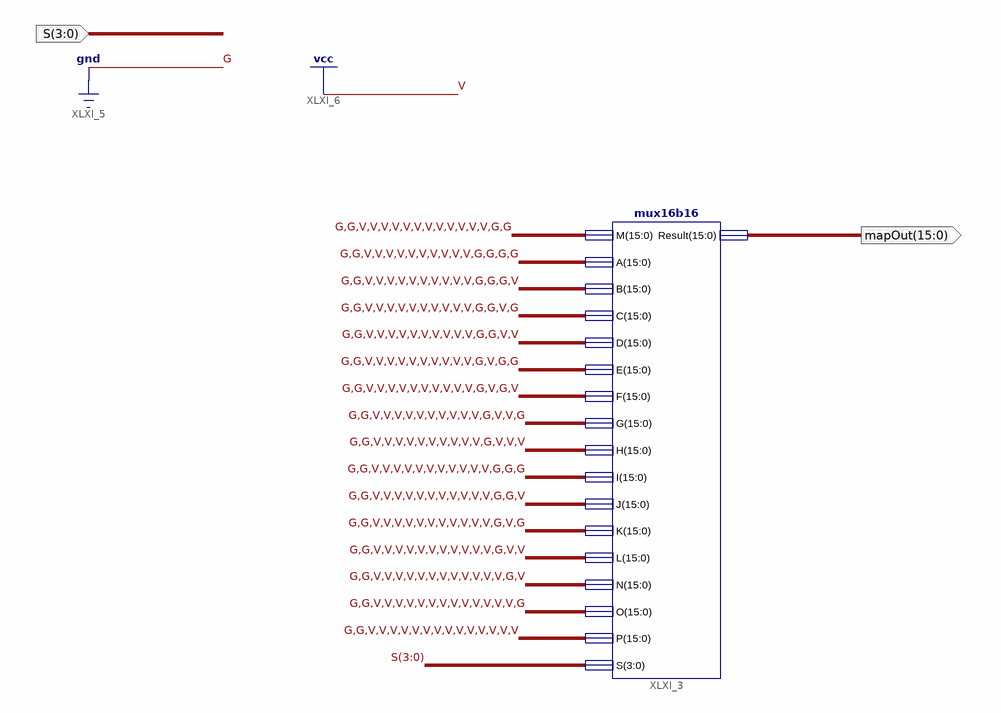
[diagram p0: schematic sheet 1]
// Xilinx ISE schematic MemoryMapDecoder.sch (spartan3e) as structural Verilog: 1 symbols, 2 ports
module MemoryMapDecoder (
  input  [3:0] S,
  output [15:0] mapOut
);

  wire G, V;

  mux16b16 XLXI_3 (
    .M({{2{G}}, {12{V}}, {2{G}}}), .A({{2{G}}, {10{V}}, {4{G}}}), .B({{2{G}}, {10{V}}, {3{G}}, V}),
    .C({{2{G}}, {10{V}}, {2{G}}, V, G}), .D({{2{G}}, {10{V}}, {2{G}}, {2{V}}}),
    .E({{2{G}}, {10{V}}, G, V, {2{G}}}), .F({{2{G}}, {10{V}}, G, V, G, V}),
    .G({{2{G}}, {10{V}}, G, {2{V}}, G}), .H({{2{G}}, {10{V}}, G, {3{V}}}), .I({{2{G}}, {11{V}}, {3{G}}}),
    .J({{2{G}}, {11{V}}, {2{G}}, V}), .K({{2{G}}, {11{V}}, G, V, G}), .L({{2{G}}, {11{V}}, G, {2{V}}}),
    .N({{2{G}}, {12{V}}, G, V}), .O({{2{G}}, {13{V}}, G}), .P({{2{G}}, {14{V}}}), .S(S), .Result(mapOut));
  // also tied to GND on the sheet: G
  // also tied to VCC on the sheet: V
endmodule
